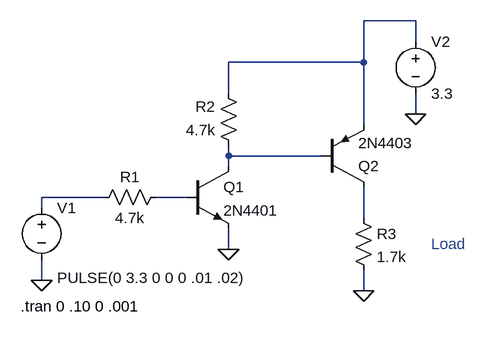
[diagram p0: schematic BJT_HighSideSwitch.asc]
BJT_HighSideSwitch.asc, the LTspice schematic file:
Version 4
SHEET 1 880 680
WIRE 448 -96 368 -96
WIRE 448 -64 448 -96
WIRE 368 -32 368 -96
WIRE 368 -32 160 -32
WIRE 160 16 160 -32
WIRE 448 48 448 16
WIRE 368 64 368 -32
WIRE 160 112 160 96
WIRE 304 112 160 112
WIRE 160 128 160 112
WIRE -32 176 -128 176
WIRE 96 176 48 176
WIRE -128 192 -128 176
WIRE 368 208 368 160
WIRE 160 256 160 224
WIRE -128 304 -128 272
WIRE 368 320 368 288
FLAG 160 256 0
FLAG 368 320 0
FLAG 448 48 0
FLAG -128 304 0
SYMBOL npn 96 128 R0
SYMATTR InstName Q1
SYMATTR Value 2N4401
SYMBOL pnp 304 160 M180
SYMATTR InstName Q2
SYMATTR Value 2N4403
SYMBOL res 64 160 R90
WINDOW 0 0 56 VBottom 2
WINDOW 3 32 56 VTop 2
SYMATTR InstName R1
SYMATTR Value 4.7k
SYMBOL res 176 112 R180
WINDOW 0 36 76 Left 2
WINDOW 3 36 40 Left 2
SYMATTR InstName R2
SYMATTR Value 4.7k
SYMBOL voltage -128 176 R0
WINDOW 3 24 124 Left 2
WINDOW 123 0 0 Left 0
WINDOW 39 0 0 Left 0
SYMATTR Value PULSE(0 3.3 0 0 0 .01 .02)
SYMATTR InstName V1
SYMBOL voltage 448 -80 R0
WINDOW 123 0 0 Left 0
WINDOW 39 0 0 Left 0
SYMATTR InstName V2
SYMATTR Value 3.3
SYMBOL res 352 192 R0
SYMATTR InstName R3
SYMATTR Value 1.7k
TEXT -160 344 Left 2 !.tran 0 .10 0 .001
TEXT 472 248 Left 2 ;Load

The netlist it stands for:
* BJT_HighSideSwitch.asc
Q1 N002 N004 0 0 2N4401
Q2 N005 N002 N001 0 2N4403
R1 N004 N003 4.7k
R2 N002 N001 4.7k
V1 N003 0 PULSE(0 3.3 0 0 0 .01 .02)
V2 N001 0 3.3
R3 N005 0 1.7k
.model NPN NPN
.model PNP PNP
.lib standard.bjt
.tran 0 .10 0 .001
* Load
.backanno
.end